# Altium schematic sheet MCB Output Connectors.SchDoc
size B
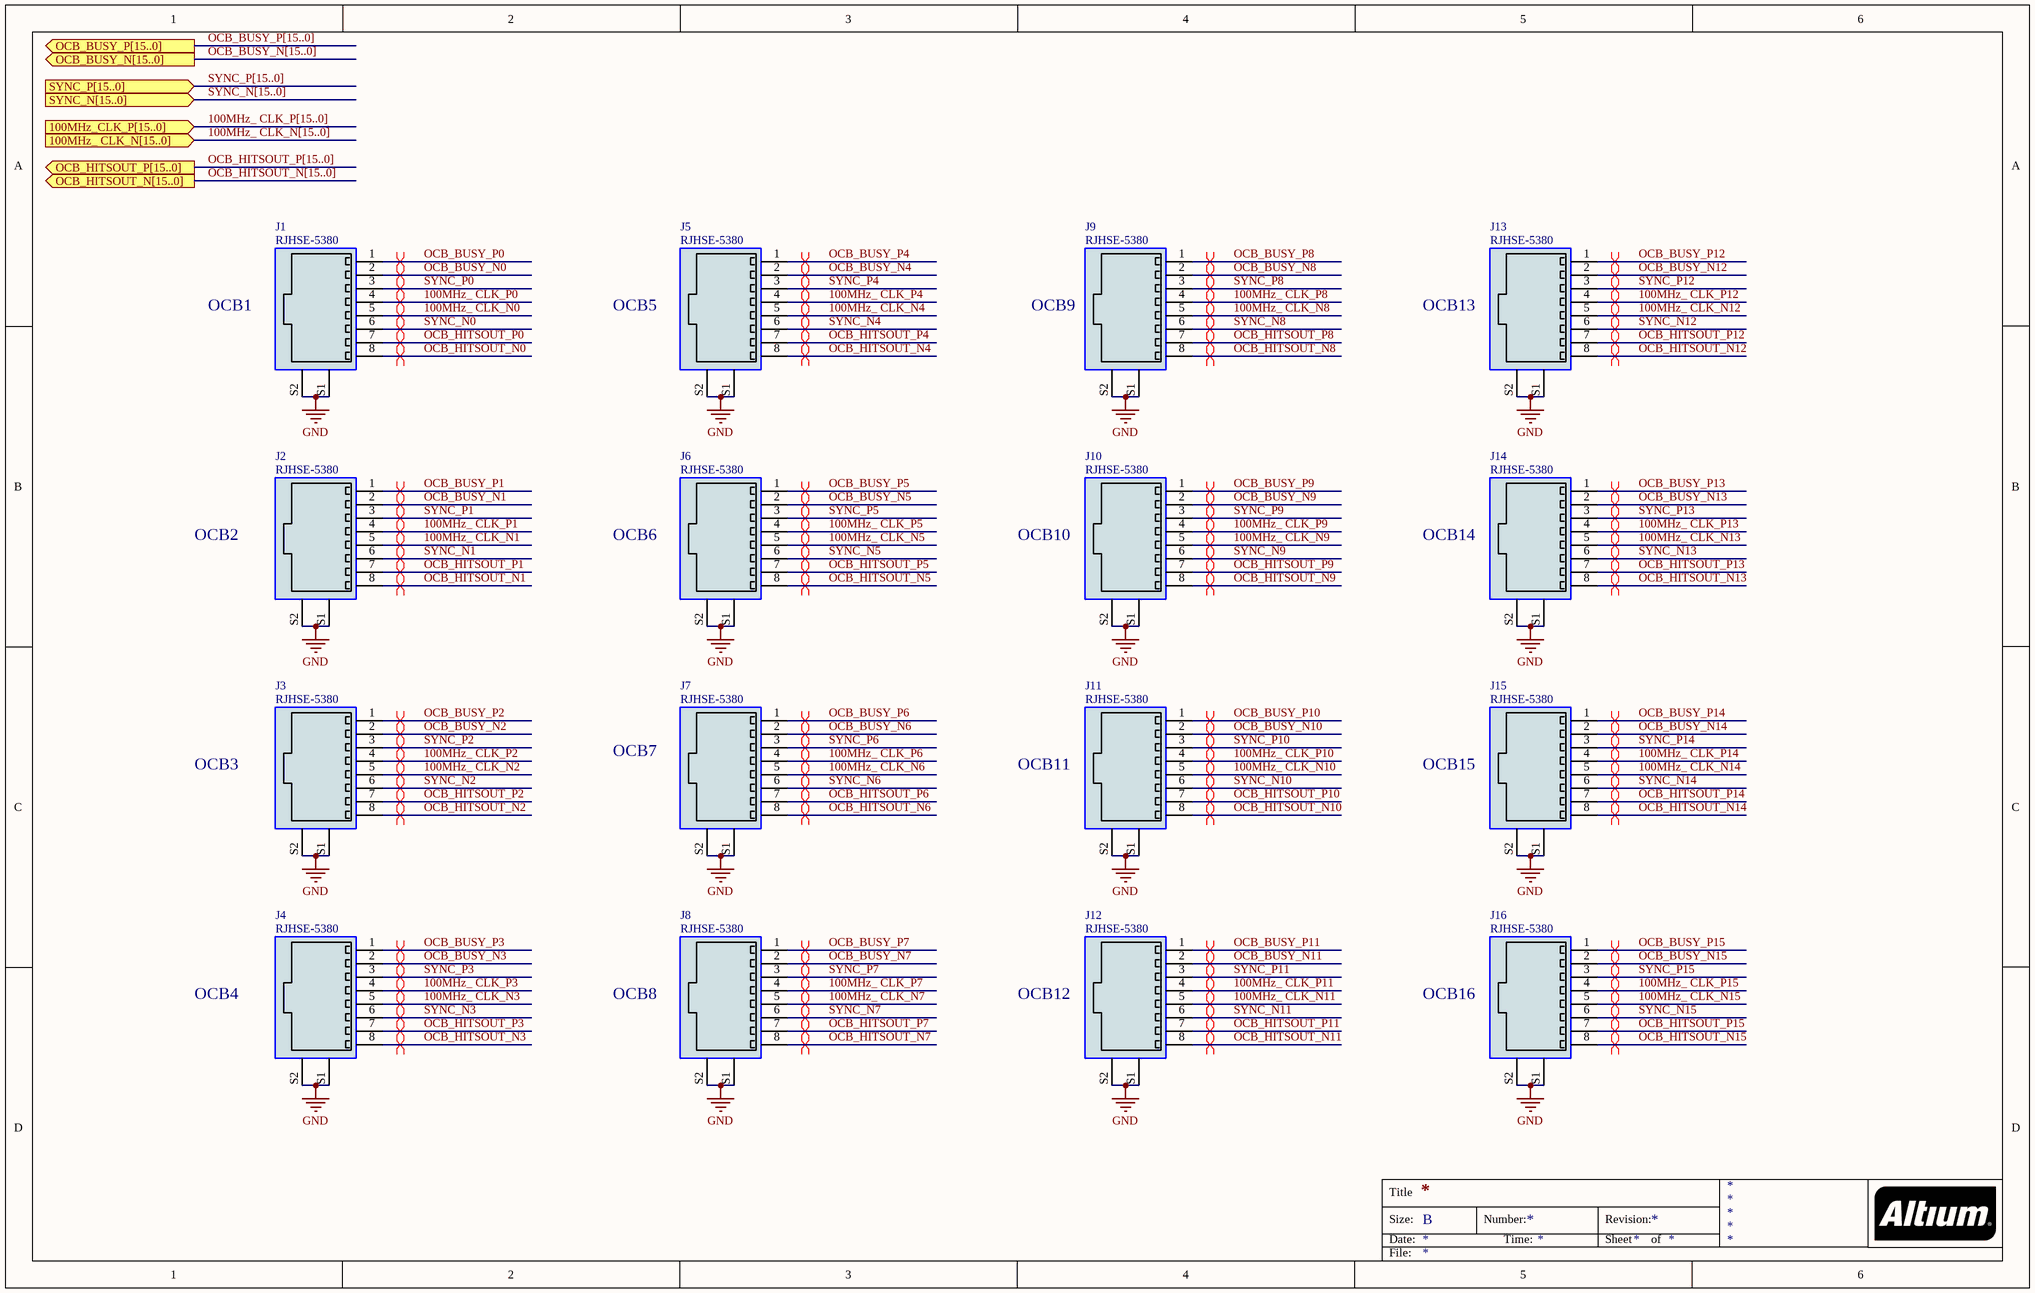
[diagram p0: MCB Output Connectors.SchDoc]

## Parts
J1  RJHSE-5380  [RJ45 Right Angle]
J2  RJHSE-5380  [RJ45 Right Angle]
J3  RJHSE-5380  [RJ45 Right Angle]
J4  RJHSE-5380  [RJ45 Right Angle]
J5  RJHSE-5380  [RJ45 Right Angle]
J6  RJHSE-5380  [RJ45 Right Angle]
J7  RJHSE-5380  [RJ45 Right Angle]
J8  RJHSE-5380  [RJ45 Right Angle]
J9  RJHSE-5380  [RJ45 Right Angle]
J10  RJHSE-5380  [RJ45 Right Angle]
J11  RJHSE-5380  [RJ45 Right Angle]
J12  RJHSE-5380  [RJ45 Right Angle]
J13  RJHSE-5380  [RJ45 Right Angle]
J14  RJHSE-5380  [RJ45 Right Angle]
J15  RJHSE-5380  [RJ45 Right Angle]
J16  RJHSE-5380  [RJ45 Right Angle]

## Ports
100MHz_ CLK_N[15..0] (in), 100MHz_CLK_P[15..0] (in), OCB_BUSY_N[15..0] (out), OCB_BUSY_P[15..0] (out), OCB_HITSOUT_N[15..0] (out), OCB_HITSOUT_P[15..0] (out), SYNC_N[15..0] (in), SYNC_P[15..0] (in)

## Nets
GND: J1.S1(SHIELD) J1.S2(SHIELD) J2.S1(SHIELD) J2.S2(SHIELD) J3.S1(SHIELD) J3.S2(SHIELD) J4.S1(SHIELD) J4.S2(SHIELD) J5.S1(SHIELD) J5.S2(SHIELD) J6.S1(SHIELD) J6.S2(SHIELD) J7.S1(SHIELD) J7.S2(SHIELD) J8.S1(SHIELD) J8.S2(SHIELD) J9.S1(SHIELD) J9.S2(SHIELD) J10.S1(SHIELD) J10.S2(SHIELD) J11.S1(SHIELD) J11.S2(SHIELD) J12.S1(SHIELD) J12.S2(SHIELD) J13.S1(SHIELD) J13.S2(SHIELD) J14.S1(SHIELD) J14.S2(SHIELD) J15.S1(SHIELD) J15.S2(SHIELD) J16.S1(SHIELD) J16.S2(SHIELD)
100MHz_ CLK_N0: J1.5
100MHz_ CLK_N1: J2.5
100MHz_ CLK_N2: J3.5
100MHz_ CLK_N3: J4.5
100MHz_ CLK_N4: J5.5
100MHz_ CLK_N5: J6.5
100MHz_ CLK_N6: J7.5
100MHz_ CLK_N7: J8.5
100MHz_ CLK_N8: J9.5
100MHz_ CLK_N9: J10.5
100MHz_ CLK_N10: J11.5
100MHz_ CLK_N11: J12.5
100MHz_ CLK_N12: J13.5
100MHz_ CLK_N13: J14.5
100MHz_ CLK_N14: J15.5
100MHz_ CLK_N15: J16.5
100MHz_ CLK_P0: J1.4
100MHz_ CLK_P1: J2.4
100MHz_ CLK_P2: J3.4
100MHz_ CLK_P3: J4.4
100MHz_ CLK_P4: J5.4
100MHz_ CLK_P5: J6.4
100MHz_ CLK_P6: J7.4
100MHz_ CLK_P7: J8.4
100MHz_ CLK_P8: J9.4
100MHz_ CLK_P9: J10.4
100MHz_ CLK_P10: J11.4
100MHz_ CLK_P11: J12.4
100MHz_ CLK_P12: J13.4
100MHz_ CLK_P13: J14.4
100MHz_ CLK_P14: J15.4
100MHz_ CLK_P15: J16.4
OCB_BUSY_N0: J1.2
OCB_BUSY_N1: J2.2
OCB_BUSY_N2: J3.2
OCB_BUSY_N3: J4.2
OCB_BUSY_N4: J5.2
OCB_BUSY_N5: J6.2
OCB_BUSY_N6: J7.2
OCB_BUSY_N7: J8.2
OCB_BUSY_N8: J9.2
OCB_BUSY_N9: J10.2
OCB_BUSY_N10: J11.2
OCB_BUSY_N11: J12.2
OCB_BUSY_N12: J13.2
OCB_BUSY_N13: J14.2
OCB_BUSY_N14: J15.2
OCB_BUSY_N15: J16.2
OCB_BUSY_P0: J1.1
OCB_BUSY_P1: J2.1
OCB_BUSY_P2: J3.1
OCB_BUSY_P3: J4.1
OCB_BUSY_P4: J5.1
OCB_BUSY_P5: J6.1
OCB_BUSY_P6: J7.1
OCB_BUSY_P7: J8.1
OCB_BUSY_P8: J9.1
OCB_BUSY_P9: J10.1
OCB_BUSY_P10: J11.1
OCB_BUSY_P11: J12.1
OCB_BUSY_P12: J13.1
OCB_BUSY_P13: J14.1
OCB_BUSY_P14: J15.1
OCB_BUSY_P15: J16.1
OCB_HITSOUT_N0: J1.8
OCB_HITSOUT_N1: J2.8
OCB_HITSOUT_N2: J3.8
OCB_HITSOUT_N3: J4.8
OCB_HITSOUT_N4: J5.8
OCB_HITSOUT_N5: J6.8
OCB_HITSOUT_N6: J7.8
OCB_HITSOUT_N7: J8.8
OCB_HITSOUT_N8: J9.8
OCB_HITSOUT_N9: J10.8
OCB_HITSOUT_N10: J11.8
OCB_HITSOUT_N11: J12.8
OCB_HITSOUT_N12: J13.8
OCB_HITSOUT_N13: J14.8
OCB_HITSOUT_N14: J15.8
OCB_HITSOUT_N15: J16.8
OCB_HITSOUT_P0: J1.7
OCB_HITSOUT_P1: J2.7
OCB_HITSOUT_P2: J3.7
OCB_HITSOUT_P3: J4.7
OCB_HITSOUT_P4: J5.7
OCB_HITSOUT_P5: J6.7
OCB_HITSOUT_P6: J7.7
OCB_HITSOUT_P7: J8.7
OCB_HITSOUT_P8: J9.7
OCB_HITSOUT_P9: J10.7
OCB_HITSOUT_P10: J11.7
OCB_HITSOUT_P11: J12.7
OCB_HITSOUT_P12: J13.7
OCB_HITSOUT_P13: J14.7
OCB_HITSOUT_P14: J15.7
OCB_HITSOUT_P15: J16.7
SYNC_N0: J1.6
SYNC_N1: J2.6
SYNC_N2: J3.6
SYNC_N3: J4.6
SYNC_N4: J5.6
SYNC_N5: J6.6
SYNC_N6: J7.6
SYNC_N7: J8.6
SYNC_N8: J9.6
SYNC_N9: J10.6
SYNC_N10: J11.6
SYNC_N11: J12.6
SYNC_N12: J13.6
SYNC_N13: J14.6
SYNC_N14: J15.6
SYNC_N15: J16.6
SYNC_P0: J1.3
SYNC_P1: J2.3
SYNC_P2: J3.3
SYNC_P3: J4.3
SYNC_P4: J5.3
SYNC_P5: J6.3
SYNC_P6: J7.3
SYNC_P7: J8.3
SYNC_P8: J9.3
SYNC_P9: J10.3
SYNC_P10: J11.3
SYNC_P11: J12.3
SYNC_P12: J13.3
SYNC_P13: J14.3
SYNC_P14: J15.3
SYNC_P15: J16.3

Not connected (* = marked no-connect by the designer): J1 9 10 11 12; J2 9 10 11 12; J3 9 10 11 12; J4 9 10 11 12; J5 9 10 11 12; J6 9 10 11 12; J7 9 10 11 12; J8 9 10 11 12; J9 9 10 11 12; J10 9 10 11 12; J11 9 10 11 12; J12 9 10 11 12; J13 9 10 11 12; J14 9 10 11 12; J15 9 10 11 12; J16 9 10 11 12

## Buses and harness runs
bus 100MHz_ CLK_N[15..0] = port 100MHz_ CLK_N[15..0]
bus 100MHz_ CLK_P[15..0] = port 100MHz_CLK_P[15..0]
bus OCB_BUSY_N[15..0] = port OCB_BUSY_N[15..0]
bus OCB_BUSY_P[15..0] = port OCB_BUSY_P[15..0]
bus OCB_HITSOUT_N[15..0] = port OCB_HITSOUT_N[15..0]
bus OCB_HITSOUT_P[15..0] = port OCB_HITSOUT_P[15..0]
bus SYNC_N[15..0] = port SYNC_N[15..0]
bus SYNC_P[15..0] = port SYNC_P[15..0]

## Layout directives
differential pair: 100MHz_ CLK_N0, 100MHz_ CLK_N1, 100MHz_ CLK_N2, 100MHz_ CLK_N3, 100MHz_ CLK_N4, 100MHz_ CLK_N5, 100MHz_ CLK_N6, 100MHz_ CLK_N7, 100MHz_ CLK_N8, 100MHz_ CLK_N9, 100MHz_ CLK_N10, 100MHz_ CLK_N11, 100MHz_ CLK_N12, 100MHz_ CLK_N13, 100MHz_ CLK_N14, 100MHz_ CLK_N15, 100MHz_ CLK_P0, 100MHz_ CLK_P1, 100MHz_ CLK_P2, 100MHz_ CLK_P3, 100MHz_ CLK_P4, 100MHz_ CLK_P5, 100MHz_ CLK_P6, 100MHz_ CLK_P7, 100MHz_ CLK_P8, 100MHz_ CLK_P9, 100MHz_ CLK_P10, 100MHz_ CLK_P11, 100MHz_ CLK_P12, 100MHz_ CLK_P13, 100MHz_ CLK_P14, 100MHz_ CLK_P15, OCB_BUSY_N0, OCB_BUSY_N1, OCB_BUSY_N2, OCB_BUSY_N3, OCB_BUSY_N4, OCB_BUSY_N5, OCB_BUSY_N6, OCB_BUSY_N7, OCB_BUSY_N8, OCB_BUSY_N9, OCB_BUSY_N10, OCB_BUSY_N11, OCB_BUSY_N12, OCB_BUSY_N13, OCB_BUSY_N14, OCB_BUSY_N15, OCB_BUSY_P0, OCB_BUSY_P1, OCB_BUSY_P2, OCB_BUSY_P3, OCB_BUSY_P4, OCB_BUSY_P5, OCB_BUSY_P6, OCB_BUSY_P7, OCB_BUSY_P8, OCB_BUSY_P9, OCB_BUSY_P10, OCB_BUSY_P11, OCB_BUSY_P12, OCB_BUSY_P13, OCB_BUSY_P14, OCB_BUSY_P15, OCB_HITSOUT_N0, OCB_HITSOUT_N1, OCB_HITSOUT_N2, OCB_HITSOUT_N3, OCB_HITSOUT_N4, OCB_HITSOUT_N5, OCB_HITSOUT_N6, OCB_HITSOUT_N7, OCB_HITSOUT_N8, OCB_HITSOUT_N9, OCB_HITSOUT_N10, OCB_HITSOUT_N11, OCB_HITSOUT_N12, OCB_HITSOUT_N13, OCB_HITSOUT_N14, OCB_HITSOUT_N15, OCB_HITSOUT_P0, OCB_HITSOUT_P1, OCB_HITSOUT_P2, OCB_HITSOUT_P3, OCB_HITSOUT_P4, OCB_HITSOUT_P5, OCB_HITSOUT_P6, OCB_HITSOUT_P7, OCB_HITSOUT_P8, OCB_HITSOUT_P9, OCB_HITSOUT_P10, OCB_HITSOUT_P11, OCB_HITSOUT_P12, OCB_HITSOUT_P13, OCB_HITSOUT_P14, OCB_HITSOUT_P15, SYNC_N0, SYNC_N1, SYNC_N2, SYNC_N3, SYNC_N4, SYNC_N5, SYNC_N6, SYNC_N7, SYNC_N8, SYNC_N9, SYNC_N10, SYNC_N11, SYNC_N12, SYNC_N13, SYNC_N14, SYNC_N15, SYNC_P0, SYNC_P1, SYNC_P2, SYNC_P3, SYNC_P4, SYNC_P5, SYNC_P6, SYNC_P7, SYNC_P8, SYNC_P9, SYNC_P10, SYNC_P11, SYNC_P12, SYNC_P13, SYNC_P14, SYNC_P15

## Notes on the sheet
- (near J1) OCB1
- OCB5
- (near J9) OCB9
- (near J13) OCB13
- OCB2
- OCB6
- (near J10) OCB10
- (near J14) OCB14
- OCB3
- OCB7
- (near J11) OCB11
- (near J15) OCB15
- OCB4
- OCB8
- (near J12) OCB12
- (near J16) OCB16
- Title
- Size:
- Date:
- B
- Number:
- Time:
- Revision:
- Sheet
- of
- File:

## Library data of the parts
J1-J16 = RJHSE-5380: Jack Modular Connector 8p8c (RJ45, Ethernet) 90° Angle (Right) Shielded, EMI Finger -; Package: None; Price: None; Value: *; Availability: Unavailable; ComponentLink1Description: Digikey; ComponentLink1URL: https://www.digikey.com/en/products/detail/amphenol-icc-commercial-products/RJHSE-5380/1242692